# EAGLE design SAM-Coupe-ATOM-Lite (EAGLE 4.01)
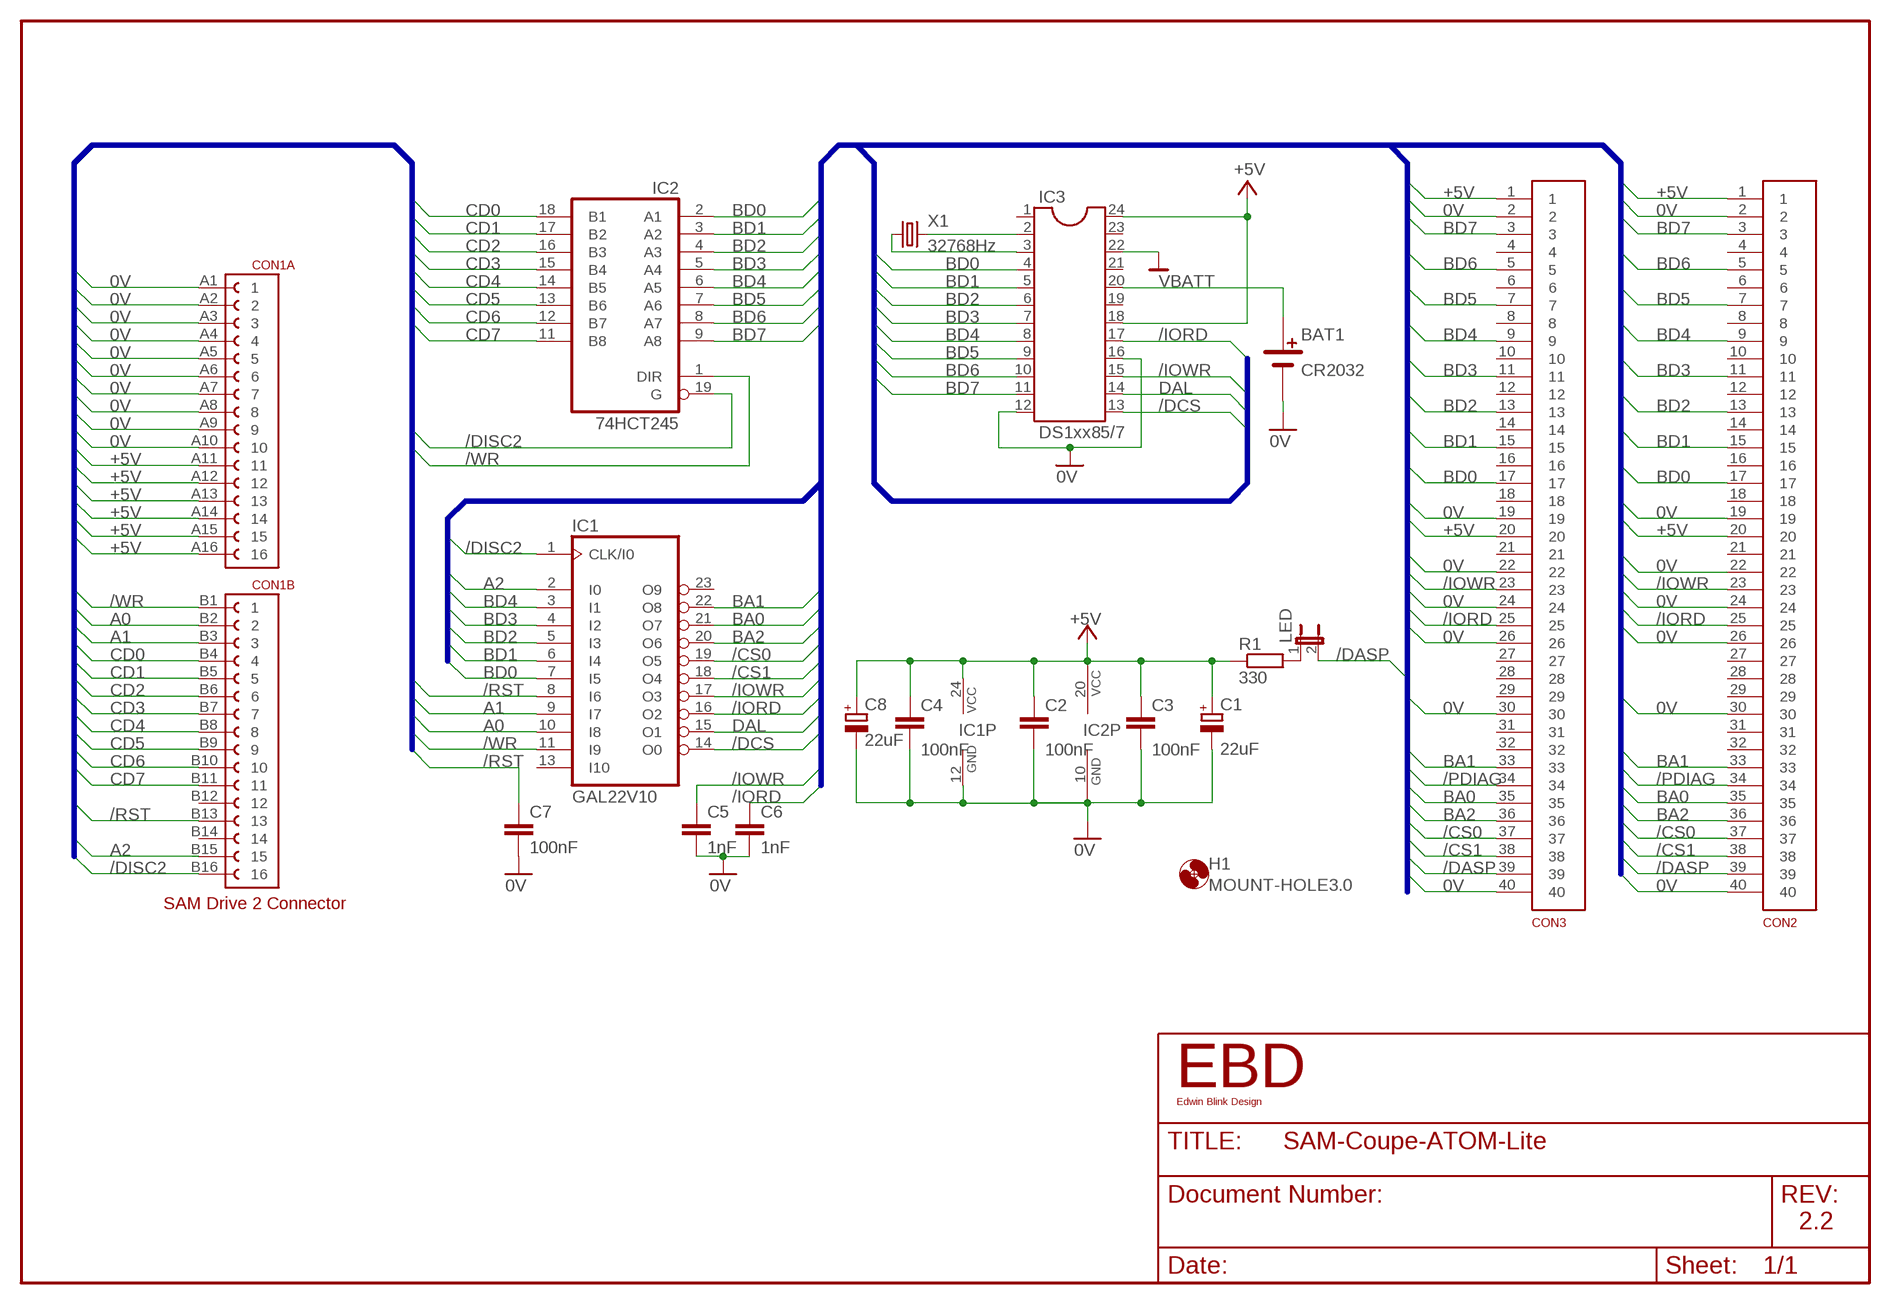
[diagram p0: schematic, sheet 1]

## Parts
BAT1  CR2032  CR2032HCR2032H  [CR2032]
C1  22uF  CPOL-EUE2.5-6  [E2,5-6]
C2  100nF  C-EU050-025X075  [C050-025X075]
C3  100nF  C-EU050-025X075  [C050-025X075]
C4  100nF  C-EU050-025X075  [C050-025X075]
C5  1nF  C-EU025-025X050  [C025-025X050]
C6  1nF  C-EU025-025X050  [C025-025X050]
C7  100nF  C-EU050-025X075  [C050-025X075]
C8  22uF  CPOL-EUE2.5-6  [E2,5-6]
CON1  EURO-48FABC  EUROCARD-48FABCEUROCARD-48FABCR  [EUROCARD-48FABCR]
CON2  IDC-40-R-REVERSEDIDC-40-R-REVERSED  [IDC-40-R-REVERSED]
CON3  IDC-40-SIDC-40-S  [IDC-40-S]
H1  MOUNT-HOLE3.0  [3,0]
IC1  GAL22V10  22V10  [DIL24-3]
IC2  74HCT245  74LS245N  [DIL20]
IC3  DS1xx85/7  DIL24/6  [DIL24-6]
LED  JP1E  [JP1]
R1  330  R-EU_0207/10  [0207/10]
X1  32768Hz  TC38H  [TC38H]

## Nets
0V: BAT1.P$1 C1.- C2.1 C3.1 C4.1 C5.1 C6.1 C7.1 C8.- CON1.A1 CON1.A2 CON1.A3 CON1.A4 CON1.A5 CON1.A6 CON1.A7 CON1.A8 CON1.A9 CON1.A10 CON2.2 CON2.19 CON2.22 CON2.24 CON2.26 CON2.30 CON2.40 CON3.2 CON3.19 CON3.22 CON3.24 CON3.26 CON3.30 CON3.40 IC1.12(GND) IC2.10(GND) IC3.12 IC3.16 IC3.22
+5V: C1.+ C2.2 C3.2 C4.2 C8.+ CON1.A11 CON1.A12 CON1.A13 CON1.A14 CON1.A15 CON1.A16 CON2.1 CON2.20 CON3.1 CON3.20 IC1.24(VCC) IC2.20(VCC) IC3.18 IC3.24 R1.1
/CS0: CON2.37 CON3.37 IC1.19(O5)
/CS1: CON2.38 CON3.38 IC1.18(O4)
/DASP: CON2.39 CON3.39 LED.2
/DCS: IC1.14(O0) IC3.13
/DISC2: CON1.B16 IC1.1(CLK/I0) IC2.19(G)
/IORD: C6.2 CON2.25 CON3.25 IC1.16(O2) IC3.17
/IOWR: C5.2 CON2.23 CON3.23 IC1.17(O3) IC3.15
/PDIAG: CON2.34 CON3.34
/RST: C7.2 CON1.B13 IC1.8(I6)
/WR: CON1.B1 IC1.11(I9) IC2.1(DIR)
A0: CON1.B2 IC1.10(I8)
A1: CON1.B3 IC1.9(I7)
A2: CON1.B15 IC1.2(I0)
BA0: CON2.35 CON3.35 IC1.21(O7)
BA1: CON2.33 CON3.33 IC1.22(O8)
BA2: CON2.36 CON3.36 IC1.20(O6)
BD0: CON2.17 CON3.17 IC1.7(I5) IC2.2(A1) IC3.4
BD1: CON2.15 CON3.15 IC1.6(I4) IC2.3(A2) IC3.5
BD2: CON2.13 CON3.13 IC1.5(I3) IC2.4(A3) IC3.6
BD3: CON2.11 CON3.11 IC1.4(I2) IC2.5(A4) IC3.7
BD4: CON2.9 CON3.9 IC1.3(I1) IC2.6(A5) IC3.8
BD5: CON2.7 CON3.7 IC2.7(A6) IC3.9
BD6: CON2.5 CON3.5 IC2.8(A7) IC3.10
BD7: CON2.3 CON3.3 IC2.9(A8) IC3.11
CD0: CON1.B4 IC2.18(B1)
CD1: CON1.B5 IC2.17(B2)
CD2: CON1.B6 IC2.16(B3)
CD3: CON1.B7 IC2.15(B4)
CD4: CON1.B8 IC2.14(B5)
CD5: CON1.B9 IC2.13(B6)
CD6: CON1.B10 IC2.12(B7)
CD7: CON1.B11 IC2.11(B8)
DAL: IC1.15(O1) IC3.14
N$16: LED.1 R1.2
VBATT: BAT1.P$2 IC3.20
X1: IC3.2 X1.2
X2: IC3.3 X1.1
Unconnected: CON1.B12 CON1.B14 CON1.C1 CON1.C2 CON1.C3 CON1.C4 CON1.C5 CON1.C6 CON1.C7 CON1.C8 CON1.C9 CON1.C10 CON1.C11 CON1.C12 CON1.C13 CON1.C14 CON1.C15 CON1.C16 CON2.4 CON2.6 CON2.8 CON2.10 CON2.12 CON2.14 CON2.16 CON2.18 CON2.21 CON2.27 CON2.28 CON2.29 CON2.31 CON2.32 CON3.4 CON3.6 CON3.8 CON3.10 CON3.12 CON3.14 CON3.16 CON3.18 CON3.21 CON3.27 CON3.28 CON3.29 CON3.31 CON3.32 IC1.13(I10) IC1.23(O9) IC3.1 IC3.19 IC3.21 IC3.23

## Buses
A[0..2],CD[0..7],/DISC2,/WR,8MHZ,/RST,+5V,0V
BA[0..2],BD[0..7],/CS0,/CS1,/IOWR,/IORD,/PDIAG,/DASP,/DCS,DAL,+5V,0V

## Notes on the sheet
- SAM Drive 2 Connector
- EBD
- Edwin Blink Design
- 2.2

## Library data of the parts
BAT1 = ebd-con:CR2032H
C1 C8 = rcl:CPOL-EU: POLARIZED CAPACITOR, European symbol
C2-C7 = rcl:C-EU: CAPACITOR, European symbol
CON1 = ebd-con:EUROCARD-48FABC: EuroCard Female 48 pins on rows A B C Right Angled
CON2 = ebd-con:IDC-40-R-REVERSED: 40 pin IDC header male right-angled Reversed pin layout
CON3 = ebd-con:IDC-40-S
H1 = holes:MOUNT-HOLE: MOUNTING HOLE with drill center marker
IC1 = pal:22V10: PAL
IC2 = 74xx-us:74*245: Octal BUS TRANSCEIVER, 3-state
IC3 = dil:DIL24: SOCKET DIL24
LED = jumper:JP1E: JUMPER
R1 = rcl:R-EU_: RESISTOR, European symbol
X1 = crystal:TC38H: CRYSTAL

## Board
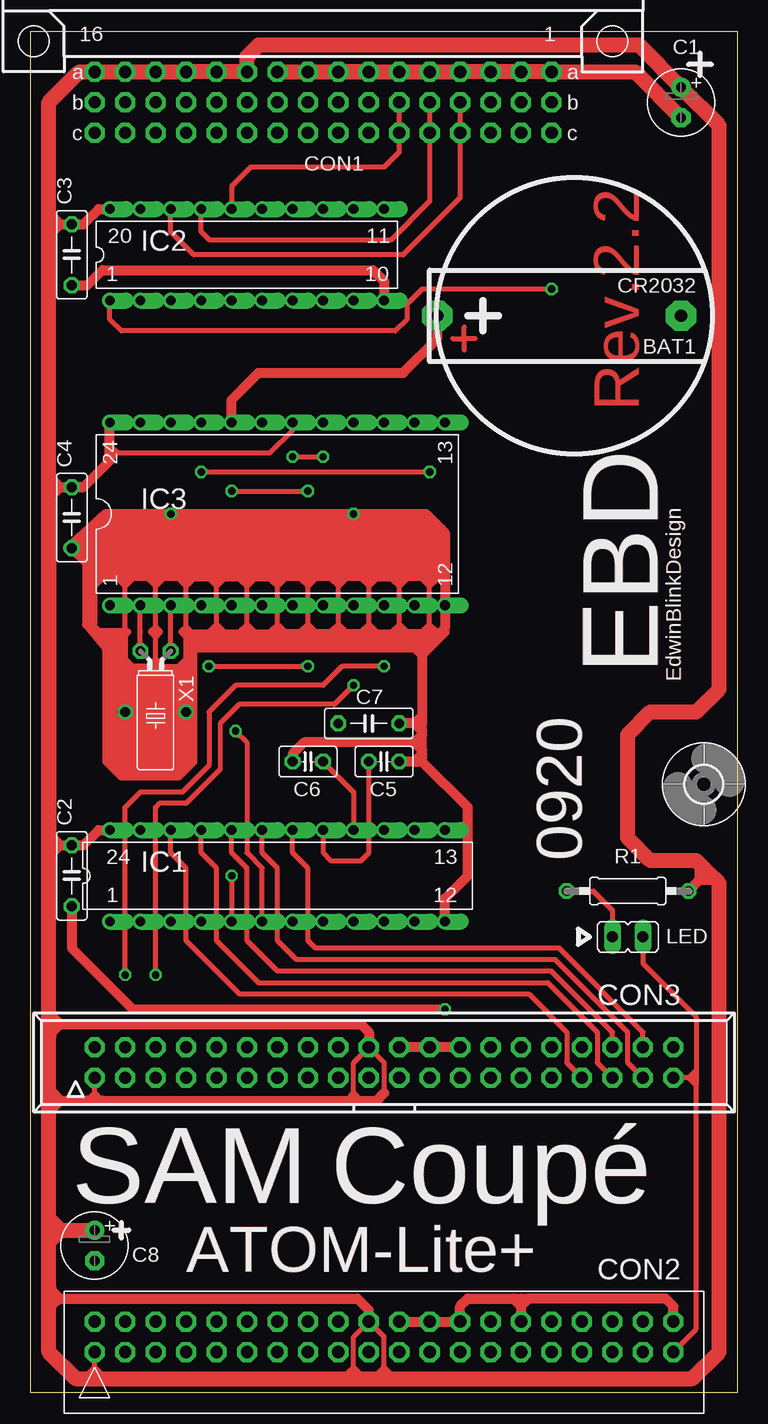
[diagram p1: board, top side]
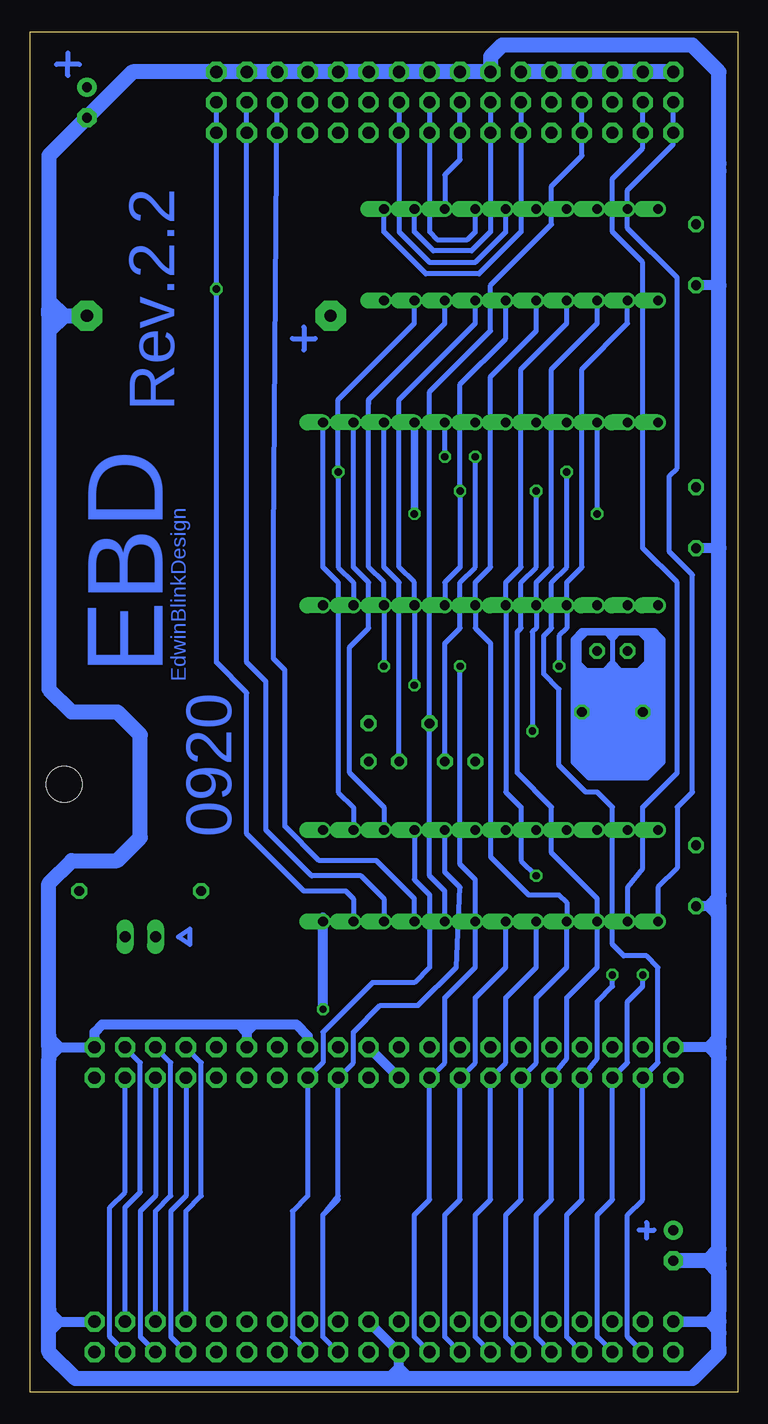
[diagram p2: board, bottom side, seen from below]

Size 59.04 x 113.33 mm. Coordinates in mm from the lower left corner, seen from the top.
Outline: 0,0 59.04,0 59.04,113.33 0,113.33 0,0
Copper layers used: Top, Bottom

### Footprints (pad centres in the part's own frame; a part is rotated, then mirrored left to right if it is on the bottom)
CR2032 = drill 1.016 pad 2.54 octagon: P$1 -8.89,0; P$2 11.43,0
E2,5-6 = drill 0.813 pad 1.6 round: + -1.27,0 | drill 0.813 pad 1.6 octagon: - 1.27,0
C050-025X075 = drill 0.813 octagon: 1 -2.54,0; 2 2.54,0
C025-025X050 = drill 0.813 octagon: 1 -1.27,0; 2 1.27,0
EUROCARD-48FABCR = drill 1.016 pad 1.676 octagon: A1 20.32,-2.54; A2 17.78,-2.54; A3 15.24,-2.54; A4 12.7,-2.54; A5 10.16,-2.54; A6 7.62,-2.54; A7 5.08,-2.54; A8 2.54,-2.54; A9 0,-2.54; A10 -2.54,-2.54; A11 -5.08,-2.54; A12 -7.62,-2.54; A13 -10.16,-2.54; A14 -12.7,-2.54; A15 -15.24,-2.54; A16 -17.78,-2.54; B1 20.32,-5.08; B2 17.78,-5.08; B3 15.24,-5.08; B4 12.7,-5.08; B5 10.16,-5.08; B6 7.62,-5.08; B7 5.08,-5.08; B8 2.54,-5.08; B9 0,-5.08; B10 -2.54,-5.08; B11 -5.08,-5.08; B12 -7.62,-5.08; B13 -10.16,-5.08; B14 -12.7,-5.08; B15 -15.24,-5.08; B16 -17.78,-5.08; C1 20.32,-7.62; C2 17.78,-7.62; C3 15.24,-7.62; C4 12.7,-7.62; C5 10.16,-7.62; C6 7.62,-7.62; C7 5.08,-7.62; C8 2.54,-7.62; C9 0,-7.62; C10 -2.54,-7.62; C11 -5.08,-7.62; C12 -7.62,-7.62; C13 -10.16,-7.62; C14 -12.7,-7.62; C15 -15.24,-7.62; C16 -17.78,-7.62
IDC-40-R-REVERSED = drill 1.016 pad 1.676 octagon: 1 25.4,2.54; 2 25.4,0; 3 22.86,2.54; 4 22.86,0; 5 20.32,2.54; 6 20.32,0; 7 17.78,2.54; 8 17.78,0; 9 15.24,2.54; 10 15.24,0; 11 12.7,2.54; 12 12.7,0; 13 10.16,2.54; 14 10.16,0; 15 7.62,2.54; 16 7.62,0; 17 5.08,2.54; 18 5.08,0; 19 2.54,2.54; 20 2.54,0; 21 0,2.54; 22 0,0; 23 -2.54,2.54; 24 -2.54,0; 25 -5.08,2.54; 26 -5.08,0; 27 -7.62,2.54; 28 -7.62,0; 29 -10.16,2.54; 30 -10.16,0; 31 -12.7,2.54; 32 -12.7,0; 33 -15.24,2.54; 34 -15.24,0; 35 -17.78,2.54; 36 -17.78,0; 37 -20.32,2.54; 38 -20.32,0; 39 -22.86,2.54; 40 -22.86,0
IDC-40-S = drill 1.016 pad 1.676 octagon: 1 -24.13,-1.27; 2 -24.13,1.27; 3 -21.59,-1.27; 4 -21.59,1.27; 5 -19.05,-1.27; 6 -19.05,1.27; 7 -16.51,-1.27; 8 -16.51,1.27; 9 -13.97,-1.27; 10 -13.97,1.27; 11 -11.43,-1.27; 12 -11.43,1.27; 13 -8.89,-1.27; 14 -8.89,1.27; 15 -6.35,-1.27; 16 -6.35,1.27; 17 -3.81,-1.27; 18 -3.81,1.27; 19 -1.27,-1.27; 20 -1.27,1.27; 21 1.27,-1.27; 22 1.27,1.27; 23 3.81,-1.27; 24 3.81,1.27; 25 6.35,-1.27; 26 6.35,1.27; 27 8.89,-1.27; 28 8.89,1.27; 29 11.43,-1.27; 30 11.43,1.27; 31 13.97,-1.27; 32 13.97,1.27; 33 16.51,-1.27; 34 16.51,1.27; 35 19.05,-1.27; 36 19.05,1.27; 37 21.59,-1.27; 38 21.59,1.27; 39 24.13,-1.27; 40 24.13,1.27
3,0 = hole 3: 0,0
DIL24-3 = drill 0.813 offset: 1 -13.97,-3.81; 2 -11.43,-3.81; 3 -8.89,-3.81; 4 -6.35,-3.81; 5 -3.81,-3.81; 6 -1.27,-3.81; 7 1.27,-3.81; 8 3.81,-3.81; 9 6.35,-3.81; 10 8.89,-3.81; 11 11.43,-3.81; 12 13.97,-3.81; 13 13.97,3.81; 14 11.43,3.81; 15 8.89,3.81; 16 6.35,3.81; 17 3.81,3.81; 18 1.27,3.81; 19 -1.27,3.81; 20 -3.81,3.81; 21 -6.35,3.81; 22 -8.89,3.81; 23 -11.43,3.81; 24 -13.97,3.81
DIL20 = drill 0.813 offset: 1 -11.43,-3.81; 2 -8.89,-3.81; 3 -6.35,-3.81; 4 -3.81,-3.81; 5 -1.27,-3.81; 6 1.27,-3.81; 7 3.81,-3.81; 8 6.35,-3.81; 9 8.89,-3.81; 10 11.43,-3.81; 11 11.43,3.81; 12 8.89,3.81; 13 6.35,3.81; 14 3.81,3.81; 15 1.27,3.81; 16 -1.27,3.81; 17 -3.81,3.81; 18 -6.35,3.81; 19 -8.89,3.81; 20 -11.43,3.81
DIL24-6 = drill 0.813 offset: 1 -13.97,-7.62; 2 -11.43,-7.62; 3 -8.89,-7.62; 4 -6.35,-7.62; 5 -3.81,-7.62; 6 -1.27,-7.62; 7 1.27,-7.62; 8 3.81,-7.62; 9 6.35,-7.62; 10 8.89,-7.62; 11 11.43,-7.62; 12 13.97,-7.62; 13 13.97,7.62; 14 11.43,7.62; 15 8.89,7.62; 16 6.35,7.62; 17 3.81,7.62; 18 1.27,7.62; 19 -1.27,7.62; 20 -3.81,7.62; 21 -6.35,7.62; 22 -8.89,7.62; 23 -11.43,7.62; 24 -13.97,7.62
JP1 = drill 0.914 long: 1 0,-1.27; 2 0,1.27
0207/10 = drill 0.813 octagon: 1 -5.08,0; 2 5.08,0
TC38H = drill 0.813 octagon: 1 -1.27,0; 2 1.27,0

### Placement (x,y rotation side)
BAT1  45.4,89.69 180 top
C1  54.29,107.47 270 top
C2  3.49,43.02 90 top
C3  3.49,94.77 90 top
C4  3.49,72.86 90 top
C5  29.52,52.54 180 top
C6  23.17,52.54 0 top
C7  28.25,55.72 180 top
C8  5.39,12.22 270 top
CON1  23.17,112.55 0 top
CON2  30.79,5.87 180 top
CON3  29.52,27.46 0 top
H1  56.19,50.63 0 top
IC1  20.63,43.02 0 top
IC2  18.09,94.77 0 top
IC3  20.63,73.18 0 top
LED  49.84,37.93 270 top
R1  49.84,41.74 180 top
X1  10.47,61.75 180 top

### Tracks (layer width: path | path; a pad name or v marks a point on that pad's centre or on a via)
0V  (via drill 0.61)
  Top 0.406: 5.39,67.78 4.76,67.78 5.39,67.14 | 34.6,67.78 5.39,67.78 | 5.39,67.14 6.03,67.78 | 5.39,67.14 5.39,63.97 | 5.39,67.78 5.39,67.14 | 33.33,67.14 33.33,67.78 | 33.33,67.14 33.97,67.78 | 33.33,63.97 33.33,67.14 | 33.33,62.38 33.33,63.97 | 33.33,63.97 33.97,63.33 | 33.33,67.14 32.7,67.78 31.43,67.78 30.79,67.14 | 33.33,63.97 32.7,63.33 31.43,63.33 30.79,63.97 | 30.79,67.14 30.79,67.78 | 30.79,63.97 30.79,67.14 | 30.79,63.97 30.79,63.02 | 30.79,67.14 30.16,67.78 28.89,67.78 28.25,67.14 | 30.79,63.97 30.16,63.33 28.89,63.33 28.25,63.97 | 28.25,67.14 28.25,67.78 | 28.25,63.97 28.25,67.14 | 28.25,62.07 28.25,63.97 | 28.25,67.14 27.62,67.78 26.35,67.78 25.71,67.14 | 28.25,63.97 27.62,63.33 26.35,63.33 25.71,63.97 | 25.71,67.14 25.71,67.78 | 25.71,63.97 25.71,67.14 | 25.71,63.97 25.71,63.02 | 25.71,67.14 25.08,67.78 23.81,67.78 23.17,67.14 | 25.71,63.97 25.08,63.33 23.81,63.33 23.17,63.97 | 23.17,67.14 23.17,67.46 | 23.17,63.97 23.17,67.14 | 23.17,63.97 23.17,63.33 | 23.17,67.14 22.54,67.78 21.27,67.78 20.63,67.14 | 23.17,63.97 22.54,63.33 21.27,63.33 20.63,63.97 | 20.63,67.14 20.63,67.78 | 20.63,63.97 20.63,67.14 | 20.63,63.97 20.63,63.02 | 20.63,67.14 20,67.78 18.73,67.78 18.09,67.14 | 20.63,63.97 20,63.33 18.73,63.33 18.09,63.97 | 18.09,67.14 18.09,67.78 | 18.09,63.97 18.09,67.14 | 18.09,63.97 18.09,63.02 | 18.09,67.14 17.46,67.78 16.19,67.78 15.55,67.14 | 18.09,63.97 17.46,63.33 16.19,63.33 15.55,63.97 | 10.47,67.14 10.47,67.46 | 10.47,67.14 9.84,67.78 | 15.55,67.14 15.55,67.78 | 15.55,63.97 15.55,67.14 | 15.55,63.97 15.55,63.02 | 10.47,67.14 11.11,67.78 12.38,67.78 13.01,67.14 | 15.55,67.14 14.92,67.78 13.65,67.78 13.01,67.14
  Top 0.406: 14.92,63.33 15.55,63.97 | 13.33,63.33 14.92,63.33 | 13.01,67.14 13.01,67.78 | 13.01,67.14 13.01,63.65 13.01,63.02 | 10.47,67.14 10.47,63.65 10.47,63.02 10.47,61.11 | 10.47,61.11 9.84,60.48 | 9.84,60.48 8.57,60.48 7.93,61.11 7.93,63.02 | 7.93,63.02 7.93,63.33 | 11.11,60.48 10.47,61.11 | 11.11,60.48 12.38,60.48 13.01,61.11 13.01,63.02 | 13.33,63.33 13.01,63.02 | 13.33,63.33 13.96,63.02 13.65,62.07 13.33,63.33 | 7.93,67.14 7.93,67.78 | 7.93,63.65 7.93,67.14 | 7.93,63.65 7.61,63.33 7.93,63.02 | 7.93,67.14 8.57,67.78 | 7.93,67.14 7.3,67.78 | 7.93,63.65 8.25,63.33 7.93,63.02 | 14.92,63.33 34.28,63.33 34.6,63.65 | 10.47,61.11 10.47,60.48 | 11.11,60.48 9.84,60.48 | 11.11,60.48 6.34,60.48 13.65,60.48 | CON3.22 CON3.24 CON3.26
  Top 0.61: 6.34,62.07 6.34,61.75 | 6.34,61.75 6.34,60.48 6.34,52.54 | 6.34,52.54 6.98,51.91 | 7.61,51.27 12.38,51.27 | 13.65,52.54 13.01,51.91 | 13.65,52.54 13.65,60.48 13.65,62.07 | 13.33,63.33 13.01,63.65 12.7,63.33 13.01,63.02 | 6.34,63.33 7.61,63.33 | 6.34,63.33 5.39,63.33 4.76,63.97 5.71,63.33 5.07,63.97 | 6.34,63.33 6.34,61.75 | 6.34,52.54 7.3,52.54 6.98,52.22 6.98,51.91 | 6.98,51.91 7.61,51.27 | 7.61,51.27 7.61,52.54 | 13.65,52.54 12.38,52.54 | 12.38,52.54 12.38,51.27 | 13.01,51.91 12.38,51.27 | 13.01,51.91 12.38,52.54 | 6.34,71.91 4.76,71.91 | 6.34,71.91 6.34,73.18 5.71,72.54 6.34,71.91 | 10.47,63.65 10.16,63.33 10.47,63.02 10.79,63.33 10.47,63.65
  Top 0.813: CON2.24 CON2.26 | CON2.24 CON2.26 | CON2.24 CON2.26 | 40.32,7.77 40.95,7.77 | 40.95,7.77 41.59,7.77 | CON3.22 CON3.24 CON3.26 | CON2.22 CON2.24 | 40.95,7.77 40.95,7.14 | 40.95,7.14 CON2.30 | CON2.22 CON2.24 | 34.6,71.59 34.6,67.78 IC3.12 34.6,63.65 33.33,62.38 33.02,62.07 32.7,62.07 | 33.02,73.18 v26.98,73.18 v11.74,73.18 | C4.1 4.76,69.05 | 4.76,69.05 4.76,63.97 6.34,62.07 | 13.65,62.07 28.25,62.07 32.06,62.07 | 32.06,62.07 32.7,62.07 | C3.1 4.76,92.23 6.03,93.5 28.57,93.5 29.52,92.55 IC2.10 | C4.1 3.17,70.32 6.34,73.18 v11.74,73.18 | v11.74,73.18 33.02,73.18 | 33.97,72.22 34.6,71.59 | CON2.22 CON2.26 | CON2.26 35.87,7.14 36.51,7.77 40.32,7.77 | 40.32,7.77 40.95,7.14 | 40.95,7.14 41.59,7.77 | 41.59,7.77 53.02,7.77 53.65,7.14 CON2.40 | C4.1 4.76,70.32 4.76,71.59 4.12,70.96 4.12,70.64 4.76,70 4.76,69.05 | 33.02,71.59 34.6,71.59 | 33.02,73.18 33.02,71.59 | 33.02,73.18 33.97,72.22 | 33.97,72.22 33.65,72.22 33.02,71.59 | C6.1 21.9,53.17 22.85,54.13 32.06,54.13 | 32.06,54.13 32.7,54.76 | 32.7,53.49 32.06,54.13 | C2.1 3.49,36.98 8.57,31.9 v34.6,31.9 | IC1.12 34.6,41.11 36.51,43.02 36.51,48.73 32.7,52.54 | 32.7,52.54 32.06,52.54 | 32.06,52.54 C5.1 | 32.06,52.54 32.38,52.54 32.7,52.86 32.7,53.17 | 32.7,53.17 32.7,53.49 | 32.7,53.49 32.7,54.76 | 32.7,54.76 32.7,55.08 | 32.7,55.08 32.7,55.72 | 32.06,55.72 C7.1 | 32.7,55.72 32.06,55.72 | 32.7,56.35 32.7,55.72 | 32.7,61.43 32.7,56.35 | 32.7,62.07 32.7,61.43 | 32.7,56.35 32.06,55.72 | 32.7,55.08 32.06,55.72 | 32.06,52.54 32.7,53.17 | 32.7,52.54 32.7,53.17 | 32.06,62.07 32.7,61.43 | 32.7,61.43 34.6,63.33
  Top 1.27: CON1.A7 CON1.A8 CON1.A9 CON1.A10 CON1.A7 | CON1.A7 28.89,110.01 | CON1.A7 CON1.A6 CON1.A5 CON1.A4 CON1.A3 CON1.A2 CON1.A1 50.48,110.01 C1.-
  Bottom 0.406: 1.58,3.65 3.8,1.1 | v11.74,73.18 IC3.22
  Bottom 0.61: CON1.A10 50.48,110.01 57.46,103.02 57.46,89.69 57.46,58.57 | 51.75,56.67 51.75,56.35 55.24,56.35 55.56,56.67 | v26.98,73.18 IC3.16
  Bottom 0.813: 2.54,5.87 CON2.2 1.58,5.87 2.54,5.87 | 56.51,5.87 CON2.40 57.46,5.87 | 28.25,1.1 28.25,2.06 | 28.25,2.06 CON2.19 CON2.22 | 1.58,28.73 2.54,28.73 | v34.6,31.9 IC1.12 | IC1.12 34.6,39.52 | 40.95,30.63 40.32,30.63 | 40.95,30.63 40.95,30 | 40.95,30 CON3.30 | 53.02,30.63 40.95,30.63 | 57.46,28.73 56.51,28.73 | 56.51,28.73 CON3.40 | 2.54,40.47 1.58,40.47 C2.1 | 2.54,40.47 C2.1 | C2.1 3.49,40.79 | 27.3,1.1 28.25,2.06 | 28.25,2.06 29.2,1.1 | 57.46,5.87 56.51,5.87 | 56.51,5.87 57.46,6.82 | 57.46,5.23 57.15,5.23 56.51,5.87 | 57.46,29.68 56.51,28.73 | 56.51,28.73 57.46,27.78 | 2.54,5.87 1.58,6.82 | 1.58,4.91 2.54,5.87 | 2.54,28.73 CON3.2 | 2.54,28.73 1.58,29.68 1.58,27.78 2.54,28.73 | 1.58,41.43 2.54,40.47 | 1.58,39.84 1.9,39.84 2.54,40.47 | 1.58,92.23 C3.1 | 1.58,70.32 C4.1 | 57.46,5.87 57.46,28.73 | 57.46,28.73 CON3.40 | CON3.40 53.65,30 53.02,30.63 | 53.02,30.63 41.59,30.63 40.95,30 | 40.95,30 40.32,30.63 | 40.32,30.63 36.83,30.63 35.87,29.68 CON3.26 | v34.6,31.9 IC1.12 | v34.6,31.9 IC1.12 | 5.39,11.26 C8.- | 1.9,10.95 2.54,10.95 | CON3.22 CON3.19 CON3.22
  Bottom 1.27: 1.58,4.91 1.58,3.65 1.58,3.33 | 1.58,101.75 1.58,110.01 | 57.46,88.42 57.46,58.57 55.56,56.67 51.75,56.67 49.84,54.76 49.84,46.19 51.75,44.28 55.56,44.28 57.46,42.38 57.46,29.68 57.46,28.73 57.46,27.78 57.46,6.82 57.46,5.87 57.46,5.23 57.46,3.33 55.24,1.1 29.2,1.1 28.25,1.1 27.3,1.1 3.8,1.1 1.58,3.33 | 1.58,9.99 1.58,7.14 | 1.58,101.75 1.58,102.39 | 1.58,40.47 1.58,41.43 1.58,70.32 | 1.58,92.23 1.58,101.75 | 1.58,110.01 3.8,112.23 19.68,112.23 20.63,111.28 CON1.A10 CON1.A1 50.48,110.01 C1.- 57.46,103.02 57.46,90.96 | 1.58,92.23 1.58,110.01 | 57.46,90.96 57.46,90.32 | 56.19,89.69 56.83,89.69 57.46,90.32 | 57.46,89.69 57.46,88.42 | 57.46,89.69 57.46,90.32 | 57.46,88.42 56.19,89.69 | 57.46,90.96 56.19,89.69 | 1.58,9.99 1.58,6.82 1.58,5.87 | 1.58,11.9 1.58,27.78 1.58,28.73 1.58,29.68 1.58,39.84 1.58,40.47 | 1.58,4.91 1.58,5.87 | 1.58,3.33 1.58,4.91 | 56.19,89.69 BAT1.P$1 | 57.46,89.69 56.19,89.69 | 1.58,70.32 1.58,92.23 | 1.58,40.47 1.58,70.32 | 1.58,3.33 1.58,5.87 | 1.58,5.87 1.58,9.99 | 1.58,9.99 1.58,11.9 | 1.58,11.9 1.58,40.47 | 1.58,9.99 1.58,10.63 1.9,10.95 | 2.54,10.95 C8.- | 1.58,11.9 2.54,10.95 | 2.54,10.95 1.58,9.99
+5V
  Top 0.406: 29.52,2.06 29.52,1.1 29.52,4.6 | 29.52,2.06 29.52,4.6 | 26.98,2.06 26.98,1.1 26.98,4.6 | 26.98,24.28 26.98,24.92 | 26.98,24.92 26.98,27.46 CON3.20 29.52,27.46 29.52,24.92 | 5.39,2.06 CON2.1 | 5.39,2.06 5.39,1.1 3.8,1.1 | 29.52,2.06 28.89,1.42 30.16,1.42 29.52,2.06 | 26.98,2.06 27.62,1.42 26.35,1.42 26.98,2.06 | 5.39,2.06 4.76,1.42 6.03,1.42 5.39,2.06 | 5.39,24.28 5.39,24.92 | 5.39,24.92 CON3.1 | 26.98,2.06 26.98,4.6 | 29.52,4.6 CON2.20 26.98,4.6 | 7.3,78.26 20,78.26 | 7.3,78.26 6.66,78.26 20,78.26 | 7.3,78.26 6.98,77.94 6.98,78.58 7.3,78.26 | IC3.18 21.9,80.16 20,78.26 | 5.39,24.92 4.76,24.28 5.71,24.28 | 5.39,24.92 6.03,24.28 | 26.98,24.92 26.66,24.6 27.3,24.6 26.98,24.92
  Top 0.813: 29.52,24.92 28.89,24.28 26.98,24.28 6.03,24.28 5.71,24.28 5.39,24.28 4.76,24.28 2.54,24.28 | IC2.20 5.71,98.58 4.44,97.31 C3.2 2.54,97.31 | 1.58,97.31 2.54,97.31 | 1.58,45.56 2.54,45.56 | 2.54,45.56 C2.2 4.44,45.56 5.71,46.82 IC1.24 | 4.44,75.4 C4.2 2.54,75.4 | IC3.24 6.66,78.26 6.66,77.62 4.44,75.4 | 2.54,75.4 1.58,75.4 4.44,75.4 | 2.54,45.56 1.58,46.51 1.58,44.6 2.54,45.56 | 1.58,76.35 2.54,75.4 | 1.58,74.45 2.54,75.4 | 2.54,97.31 1.58,98.26 1.58,96.36 2.54,97.31 | 55.87,42.7 R1.1 | 56.51,43.33 55.87,42.7 | 55.87,42.7 55.87,43.65 56.83,42.7 55.87,42.7 | 1.58,24.28 2.54,24.28 | 2.54,24.28 1.9,24.92 1.9,23.65 2.54,24.28 | CON2.20 28.25,6.82 27.3,7.77 2.54,7.77 | 1.58,8.73 2.54,7.77 | 1.58,7.14 2.54,7.77 | CON3.20 28.25,30 27.62,30.63 2.54,30.63 | 1.58,31.59 2.54,30.63 | 1.58,29.68 2.54,30.63 | 1.58,13.8 1.9,13.49 2.54,13.49 | 1.58,14.44 1.58,12.53
  Top 1.27: 1.58,31.59 1.58,44.6 1.58,45.56 1.58,46.51 1.58,74.45 1.58,75.4 | 1.58,75.4 1.58,76.35 1.58,96.36 1.58,97.31 1.58,98.26 1.58,107.47 4.12,110.01 CON1.A16 CON1.A15 CON1.A14 CON1.A13 CON1.A12 CON1.A11 18.09,111.28 19.05,112.23 50.79,112.23 C1.+ 57.46,105.56 57.46,58.57 55.56,56.67 51.75,56.67 49.84,54.76 49.84,46.19 51.75,44.28 55.56,44.28 56.51,43.33 57.46,42.38 57.46,3.33 55.24,1.1 29.52,1.1 26.98,1.1 3.8,1.1 1.58,3.33 | 1.58,31.59 1.58,29.68 1.58,24.28 1.58,14.44 | 1.58,31.59 1.58,75.4 | 1.58,3.33 1.58,7.14 1.58,8.73 1.58,12.53 | 1.58,14.44 1.58,13.8 1.58,12.53 | 1.58,3.33 1.58,12.53 | 2.54,13.49 C8.+ | 2.54,13.49 1.58,14.44 | 1.58,12.53 2.54,13.49
  Bottom 1.27: CON1.A16 CON1.A11
/CS0
  Top 0.406: CON3.37 49.84,27.46 49.84,30 43.81,36.03 22.22,36.03 20.63,37.62 20.63,43.65 19.36,44.92 IC1.19
  Bottom 0.406: CON2.37 52.38,4.6 52.38,15.39 51.11,16.66 CON3.37
/CS1
  Top 0.406: CON3.38 51.11,30 44.13,36.98 23.81,36.98 23.17,37.62 23.17,43.65 21.9,44.92 IC1.18
  Bottom 0.406: CON3.38 49.84,27.46 49.84,16.66 51.11,15.39 CON2.38
/DASP
  Top 0.406: 55.56,25.55 55.56,5.23 CON2.39 | LED.2 51.11,35.71 55.56,31.27 55.56,26.82 | 55.56,26.19 54.92,26.19 | 54.92,26.19 CON3.39 | 54.92,26.19 55.56,26.82 | 55.56,26.82 55.56,26.19 | 55.56,26.19 55.56,25.55 | 55.56,25.55 54.92,26.19
/DCS
  Bottom 0.406: IC3.13 34.6,68.73 33.33,67.46 33.33,50 32.06,48.73 IC1.14
/DISC2
  Bottom 0.406: CON1.B16 5.39,103.97 9.2,100.16 IC2.19 9.2,96.99 5.07,92.86 5.07,76.99 5.71,76.35 5.71,70 3.8,68.1 3.8,50 5.07,48.73 5.07,43.65 6.66,42.06 IC1.1
/IORD  (via drill 0.61)
  Top 0.406: v21.9,77.94 v24.44,77.94 | C6.2 26.98,50 IC1.16
  Bottom 0.406: v24.44,77.94 IC3.17 | v21.9,77.94 21.9,68.73 23.17,67.46 23.17,63.65 24.44,62.38 C6.2 | IC1.16 26.98,42.7 25.71,41.43 25.71,35.39 26.98,34.13 30.48,34.13 34.6,30 34.6,27.46 CON3.25 35.87,16.35 37.14,15.08 37.14,4.6 CON2.25
/IOWR
  Top 0.406: IC1.17 24.44,44.92 25.08,44.28 27.62,44.28 28.25,44.92 C5.2
  Bottom 0.406: 34.6,14.76 33.33,16.35 CON3.23 | IC3.15 29.52,68.73 28.25,67.46 C5.2 | CON2.23 34.6,4.6 34.6,14.76 | 34.6,14.76 33.33,16.03 CON3.23 | CON3.23 32.06,27.46 32.06,30 29.84,32.22 26.66,32.22 23.49,35.39 23.17,42.06 24.44,43.33 IC1.17
/PDIAG
  Bottom 0.406: CON2.34 46.03,15.08 44.76,16.35 44.76,27.46 CON3.34
/RST
  Bottom 0.406: CON1.B13 13.01,103.02 15.55,100.48 15.55,97.31 20.63,92.23 20.63,88.42 25.71,83.34 C7.2 25.71,43.02 24.44,41.74 IC1.8
/WR  (via drill 0.61)
  Top 0.406: IC2.1 6.66,89.37 7.61,88.42 30.48,88.42 31.43,89.37 31.43,90.64 32.7,91.91 v43.49,91.91
  Bottom 0.406: CON1.B1 v43.49,91.91 43.49,60.8 40.95,58.25 40.95,46.51 36.19,41.74 32.7,41.74 32.06,41.11 IC1.11
A0
  Bottom 0.406: CON1.B2 40.95,60.8 39.37,59.21 39.37,46.82 35.55,43.02 31.43,43.02 29.52,41.11 IC1.10
A1
  Bottom 0.406: CON1.B3 38.73,70.96 38.73,61.11 37.78,60.16 37.78,47.14 34.92,44.28 30.16,44.28 26.98,41.11 IC1.9
A2
  Bottom 0.406: CON1.B15 7.93,103.66 10.47,101.12 10.47,96.67 7.93,94.13 7.93,70.32 5.07,67.46 5.07,51.59 7.93,48.73 7.93,43.65 9.2,42.06 IC1.2
BA0
  Top 0.406: CON3.35 47.3,27.46 47.3,30 43.17,34.13 19.05,34.13 15.55,37.62 15.55,43.65 14.28,44.92 IC1.21
  Bottom 0.406: CON2.35 49.84,4.6 49.84,15.08 48.57,16.35 CON3.35
BA1
  Top 0.406: CON3.33 44.76,27.46 44.76,30 41.59,33.17 17.46,33.17 13.01,37.62 13.01,43.65 11.74,44.92 IC1.22
  Bottom 0.406: CON2.33 47.3,4.6 47.3,15.08 46.03,16.35 CON3.33
BA2
  Top 0.406: CON3.36 48.57,30 43.49,35.08 20.63,35.08 18.09,37.62 18.09,43.65 16.82,44.92 IC1.20
  Bottom 0.406: CON2.36 48.57,15.08 47.3,16.35 47.3,27.46 CON3.36
BD0  (via drill 0.61)
  Top 0.406: v14.92,60.48 v23.17,60.48
  Bottom 0.406: CON2.17 26.98,4.6 26.98,14.76 25.71,16.03 CON3.17 24.44,27.46 24.44,32.85 21.9,35.39 IC1.7 21.9,42.7 23.17,43.97 v23.17,60.48 | IC2.2 9.2,89.05 13.01,85.24 13.01,68.73 14.28,67.46 IC3.4 14.28,63.65 14.92,63.02 v14.92,60.48
BD1  (via drill 0.61)
  Top 0.406: IC1.6 19.36,43.65 18.09,44.92 18.09,54.13 v17.14,55.08
  Bottom 0.406: CON2.15 24.44,4.6 24.44,14.76 23.17,16.03 CON3.15 21.9,27.46 21.9,32.85 19.36,35.39 IC1.6 19.36,39.52 | IC2.3 11.74,89.05 15.55,85.24 15.55,68.73 16.82,67.46 IC3.5 16.82,63.65 17.14,63.33 v17.14,55.08
  other vias: 19.36,39.2
BD2  (via drill 0.61)
  Top 0.406: 16.82,38.89 IC1.5 v16.82,43.02
  Bottom 0.406: CON2.13 21.9,4.6 21.9,14.76 20.63,16.03 CON3.13 19.36,27.46 19.36,32.85 16.82,35.39 IC1.5 | IC2.4 14.28,89.05 18.09,85.24 18.09,68.73 19.36,67.46 IC3.6 19.36,50 18.09,48.73 18.09,44.28 v16.82,43.02
BD3
  Bottom 0.406: CON2.11 19.36,4.6 19.36,14.76 18.09,16.03 CON3.11 16.82,27.46 16.82,32.85 14.28,35.39 IC1.4 14.28,40.79 14.92,41.43 17.46,41.43 20.63,44.6 20.63,62.38 21.9,63.65 IC3.7 21.9,67.46 20.63,68.73 20.63,84.61 16.82,88.42 IC2.5
BD4  (via drill 0.61)
  Top 0.406: v16.82,75.08 v23.17,75.08
  Bottom 0.406: CON2.9 16.82,4.6 16.82,14.76 15.55,16.03 CON3.9 14.28,27.78 14.28,32.85 11.74,35.39 11.74,38.89 | IC2.6 19.36,87.78 23.17,83.97 v23.17,75.08 23.17,68.73 24.44,67.46 IC3.8 | 11.74,38.89 IC1.3 | 11.74,38.89 11.74,41.11 15.55,44.92 15.55,48.73 18.41,51.59 18.41,63.33 18.09,63.65 18.09,67.46 16.82,68.73 v16.82,75.08
BD5  (via drill 0.61)
  Top 0.406: v10.47,34.76 10.47,48.73 10.79,49.05 13.01,49.05 15.87,51.91 15.87,55.72 17.46,57.3 25.4,57.3 v26.98,58.89
  Bottom 0.406: CON2.7 14.28,4.6 14.28,14.76 13.01,16.03 CON3.7 11.74,27.78 11.74,32.54 10.47,33.81 v10.47,34.76 | IC2.7 21.9,89.05 28.25,82.7 28.25,68.73 26.98,67.46 IC3.9 v26.98,58.89
BD6  (via drill 0.61)
  Top 0.406: v7.93,34.76 7.93,48.73 9.2,50 12.7,50 14.92,52.22 14.92,56.67 17.14,58.89 24.44,58.89 26.03,60.48 v29.52,60.48
  Bottom 0.406: CON2.5 11.74,4.6 11.74,14.76 10.47,16.03 CON3.5 9.2,27.46 9.2,32.54 7.93,33.81 v7.93,34.76 | IC2.8 24.44,89.05 30.79,82.7 | 30.79,82.7 30.79,82.38 | 30.79,82.7 30.79,68.73 29.52,67.46 IC3.10 v29.52,60.48
BD7  (via drill 0.61)
  Top 0.406: v14.28,76.67 v33.33,76.67
  Bottom 0.406: CON2.3 9.2,4.6 9.2,14.76 7.93,16.03 CON3.3 6.66,27.46 6.66,35.39 7.61,36.35 9.52,36.35 10.47,37.3 10.47,48.73 11.74,50 12.7,50 14.92,52.22 14.92,58.57 16.19,59.84 16.19,63.02 15.55,63.65 15.55,67.46 14.28,68.73 v14.28,76.67 | IC2.9 26.98,89.05 33.33,82.7 v33.33,76.67 33.33,68.73 32.06,67.46 IC3.11
CD0
  Top 0.406: CON1.B4 35.87,99.53 31.11,94.77 13.65,94.77 11.74,96.67 IC2.18
CD1
  Top 0.406: CON1.B5 33.33,99.21 30.16,96.04 14.92,96.04 14.28,96.67 IC2.17
CD2
  Top 0.406: CON1.B6 30.79,103.34 29.52,102.07 18.41,102.07 16.82,100.48 IC2.16
CD3
  Bottom 0.406: CON1.B7 28.25,96.67 25.71,94.13 21.9,94.13 19.36,96.67 IC2.15
CD4
  Bottom 0.406: CON1.B8 25.71,96.67 25.08,96.04 22.54,96.04 21.9,96.67 IC2.14
CD5
  Bottom 0.406: CON1.B9 23.17,102.71 24.44,101.44 IC2.13
CD6
  Bottom 0.406: CON1.B10 20.63,96.67 22.22,95.08 25.4,95.08 26.98,96.67 IC2.12
CD7
  Bottom 0.406: CON1.B11 18.09,96.67 21.59,93.18 26.03,93.18 29.52,96.67 IC2.11
DAL
  Bottom 0.406: IC3.14 32.06,68.73 30.79,67.46 30.79,63.65 32.38,62.07 32.38,51.59 29.52,48.73 IC1.15
N$1  (via drill 0.81)
  other vias: 13.01,56.67
N$3
  Bottom 0.406: 11.11,63.33 10.47,62.7 9.84,63.33 | 10.47,63.33 10.47,60.8 | 10.47,60.8 9.84,60.16 | 9.84,60.16 10.47,60.16 | 10.47,60.16 11.11,60.16 | 11.11,60.16 10.47,60.8 | 10.47,60.8 10.47,60.16 | 9.84,60.16 8.25,60.16 | 8.25,60.16 7.61,60.16 7.61,60.8 | 7.61,60.8 7.61,62.7 | 7.61,62.7 7.61,63.33 | 8.25,63.33 7.61,62.7 | 7.61,60.8 8.25,60.16 | 12.7,60.16 13.33,60.16 13.33,60.8 12.7,60.16 | 12.7,60.16 11.11,60.16
  Bottom 0.61: 7.3,63.33 7.61,63.33 8.25,63.33 9.84,63.33 10.47,63.33 11.11,63.33 12.7,63.33 | 12.7,63.33 13.01,63.33 13.65,62.7 13.65,52.54 | 6.34,62.7 6.66,63.02 | 6.34,52.54 6.34,62.7 | 7.61,51.27 6.98,51.91 | 7.61,51.27 12.38,51.27 | 13.01,51.91 13.65,52.54 | 12.7,63.33 13.33,62.7 13.33,60.8 | 6.34,62.7 6.98,62.7 | 6.98,62.7 7.3,62.7 7.3,63.33 | 7.3,63.33 6.98,63.33 6.66,63.02 | 6.66,63.02 6.98,62.7 | 13.65,52.54 12.38,52.54 | 12.38,52.54 12.38,51.27 | 12.38,51.27 13.01,51.91 | 13.01,51.91 12.38,52.54 | 7.61,51.27 7.61,52.54 | 7.61,52.54 6.34,52.54 | 6.34,52.54 6.98,51.91 | 6.98,51.91 7.61,52.54
N$5
  Top 0.406: 6.98,13.49 7.61,13.49 | 8.25,13.49 7.61,13.49 | 7.61,13.49 7.61,14.12 | 7.61,13.49 7.61,12.85
N$6
  Bottom 0.406: 36.19,88.74 36.19,86.83
N$7
  Top 0.406: 7.93,61.11 7.93,60.8
N$8
  Top 0.406: 13.01,61.43 13.01,60.48 12.38,60.48
N$9
  Bottom 0.406: 37.14,87.78 35.24,87.78
N$10  (via drill 0.81)
  other vias: 7.93,56.67
N$11
  Top 0.406: 37.14,87.78 36.19,87.78 | 35.24,87.78 36.19,87.78 | 36.19,87.78 36.19,88.74 | 36.19,87.78 36.19,86.83
N$12
  Top 0.406: 55.87,111.6 55.87,110.64 | 55.87,109.69 55.87,110.64 | 55.87,110.64 56.83,110.64 | 55.87,110.64 54.92,110.64
N$13
  Bottom 0.406: 55.87,111.6 55.87,110.64 | 54.92,110.64 55.87,110.64 | 55.87,109.69 55.87,110.64 | 55.87,110.64 56.83,110.64
N$14
  Bottom 0.406: 7.61,14.12 7.61,13.49 | 7.61,12.85 7.61,13.49 | 7.61,13.49 6.98,13.49 | 7.61,13.49 8.25,13.49
N$16
  Top 0.406: R1.2 46.99,41.74 48.57,40.16 LED.1
N$18
  Top 0.406: 45.71,37.3 46.67,37.93 45.71,38.57 45.71,37.3
N$19
  Bottom 0.406: 45.71,38.57 45.71,37.3 46.67,37.93 45.71,38.57
VBATT
  Top 0.813: BAT1.P$2 33.97,87.78 31.11,84.92 19.05,84.92 16.82,82.7 IC3.20
X1
  Top 0.406: 9.2,63.33 IC3.2 X1.2
X2
  Top 0.406: X1.1 IC3.3
(copper drawn outside any net)
  shapes: Bottom area x4, Top area x7

### Text on the board
Top: Rev.2.2 | EBD | EdwinBlinkDesign | 0920 | SAM | Coupé | ATOM-Lite+
Bottom: Rev.2.2 | EdwinBlinkDesign | EBD | 0920
tPlace: EBD | EdwinBlinkDesign | SAM | Coupé | ATOM-Lite+
tNames: 0920